# EAGLE design untitled (EAGLE 8.4.1)
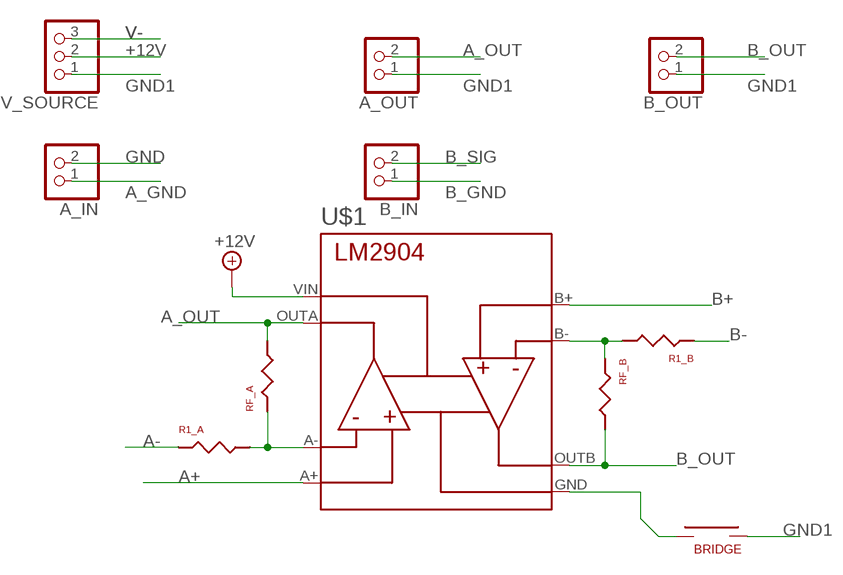
[diagram p0: schematic, sheet 1]

## Parts
A_IN  PINHD-1X2  [1X02]
A_OUT  PINHD-1X2  [1X02]
B_IN  PINHD-1X2  [1X02]
B_OUT  PINHD-1X2  [1X02]
R1_A  RESISTOR  [RESISTOR]
R1_B  RESISTOR  [RESISTOR]
RF_A  RESISTOR  [RESISTOR]
RF_B  RESISTOR  [RESISTOR]
U$1  LM2904  [LM2904]
U$2  BRIDGE  [BRIDGE]
V_SOURCE  PINHD-1X3  [1X03]

## Nets
+12V: U$1.VIN V_SOURCE.2
A+: U$1.A+
A-: R1_A.P$1
A_GND: A_IN.1
A_OUT: A_OUT.2 RF_A.P$2 U$1.OUTA
B+: U$1.B+
B-: R1_B.P$1
B_GND: B_IN.1
B_OUT: B_OUT.2 RF_B.P$2 U$1.OUTB
B_SIG: B_IN.2
GND: A_IN.2
GND1: A_OUT.1 B_OUT.1 U$2.P$2 V_SOURCE.1
N$3: R1_B.P$2 RF_B.P$1 U$1.B-
N$4: R1_A.P$2 RF_A.P$1 U$1.A-
V-: U$1.GND U$2.P$1 V_SOURCE.3

## Library data of the parts
A_IN A_OUT B_IN B_OUT = myLamp:PINHD-1X2: PIN HEADER
R1_A R1_B RF_A RF_B = myLamp:RESISTOR
U$1 = myLamp:LM2904
U$2 = myLamp:BRIDGE
V_SOURCE = myLamp:PINHD-1X3: PIN HEADER

## Board
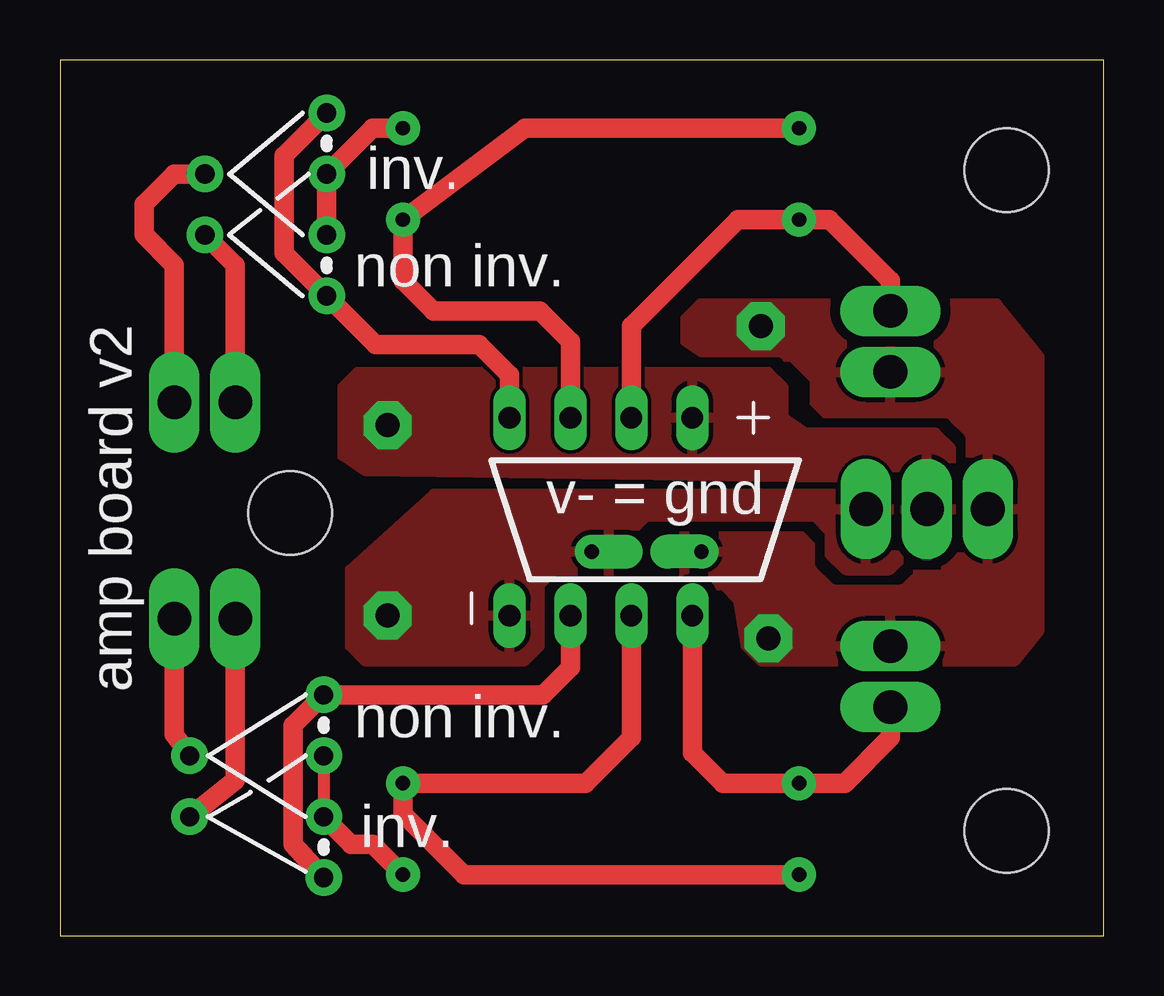
[diagram p1: board, top side]
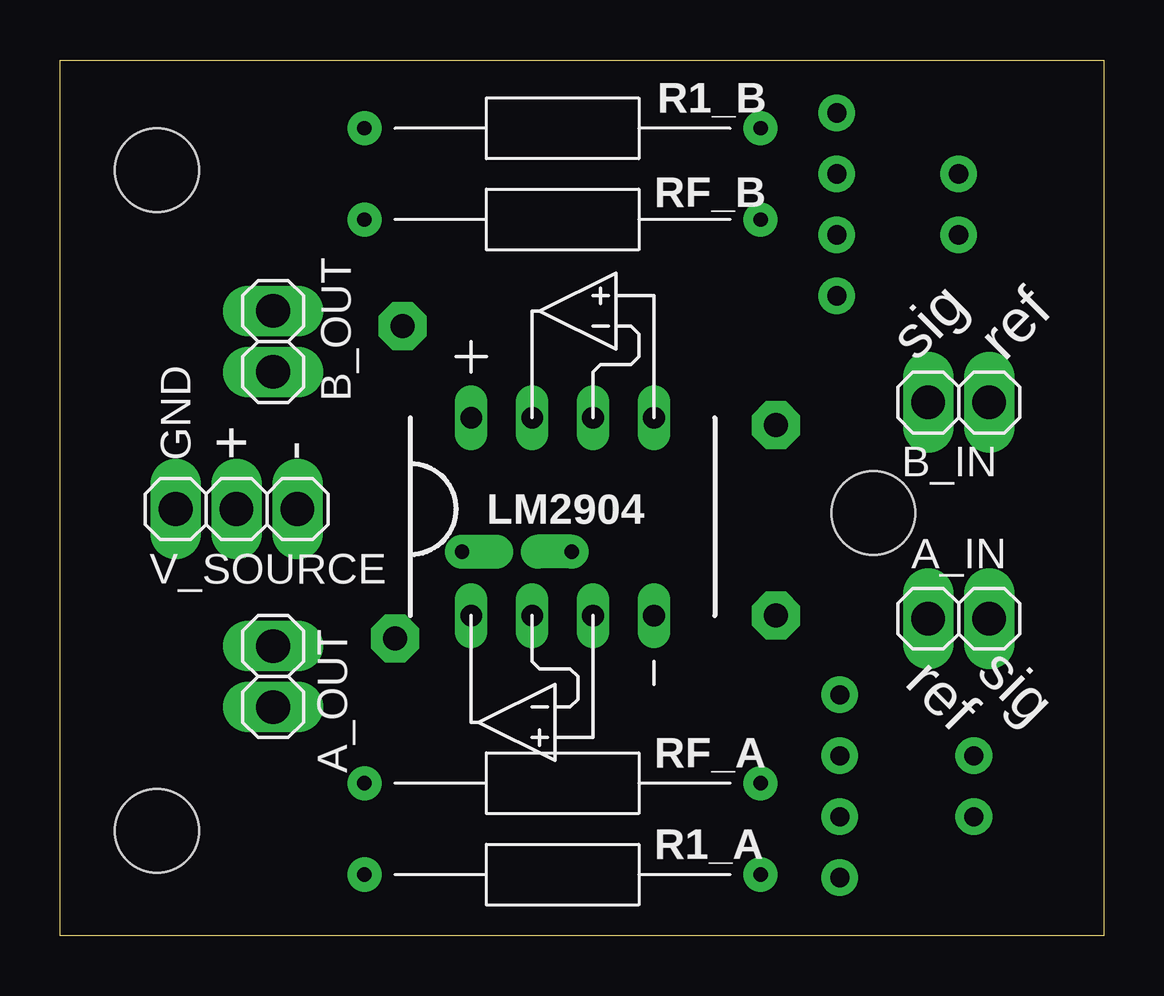
[diagram p2: board, bottom side, seen from below]

Size 43.5 x 36.5 mm. Coordinates in mm from the lower left corner, seen from the top.
Outline: 0,0 43.5,0 43.5,36.5 0,36.5 0,0
Copper layers (1*16): Top 0.018mm / dielectric 1.55mm / Bottom 0.018mm
Design rules "eC_2Layer_PClass6_BaseCopperO18_eCDefault": minimum track width 0.15mm, minimum drill 0.35mm, track to track 0.15mm, track to pad 0.15mm, pad to pad 0.15mm, via to via 0.15mm, smd to smd 0mil, copper to edge 0.25mm, drill to drill 0.35mm, minimum pad ring 0.175mm, minimum via ring 0.125mm, stop-mask expansion 0mil, vias tented up to drill 0.45mm, thermal gap 0.2mm
Holes 3.5 mm at 39.45,31.91 39.45,4.37 9.59,17.61

### Footprints (pad centres in the part's own frame; a part is rotated, then mirrored left to right if it is on the bottom)
1X02 = drill 1.4 long: 1 -1.27,0; 2 1.27,0
RESISTOR = drill 0.6 pad 1.422: P$1 0,0; P$2 16.51,0
LM2904 = drill 0.9 long: A+ 5.08,0; A- 2.54,0; B+ 7.62,8.255; B- 5.08,8.255; GND 7.62,0; OUTA 0,0; OUTB 2.54,8.255; VIN 0,8.255
BRIDGE = drill 0.6 pad 1.422 offset: P$1 0,0; P$2 4.572,0
1X03 = drill 1.4 long: 1 -2.54,0; 2 0,0; 3 2.54,0

### Placement (x,y rotation side)
A_IN  6.04,13.21 0 bottom
A_OUT  34.61,10.79 270 bottom
B_IN  6.04,22.23 180 bottom
B_OUT  34.61,24.77 90 bottom
R1_A  14.29,2.54 0 top
R1_B  14.29,33.66 0 top
RF_A  14.29,6.35 0 top
RF_B  14.29,29.84 0 top
U$1  26.36,13.34 0 bottom
U$2  22.17,16 0 top
V_SOURCE  36.14,17.78 0 bottom

### Tracks (layer width: path | path; a pad name or v marks a point on that pad's centre or on a via)
+12V  (via drill 1 pad 2)
  other vias: 13.66,21.27
  pour Top (isolate 0.127, rank 2): 11.76,22.86 11.76,20 12.71,19.37 35.25,19.05 35.25,16.51 35.88,15.88 36.52,15.88 37.16,16.51 37.16,20.32 36.52,20.95 31.12,20.95 30.17,21.59 30.17,22.86 29.54,23.5 12.39,23.5
A+  (via drill 0.8 pad 1.52)
  Top 0.813: v10.99,2.41 9.72,3.81 9.72,8.76 v10.99,10.03 20.14,10.03 21.28,11.18 U$1.A+
A-  (via drill 0.8 pad 1.52)
  Top 0.508: v10.99,7.49 v10.99,4.95
  Top 0.813: v10.99,4.95 12.14,3.81 13.03,3.81 R1_A.P$1
A_GND  (via drill 0.8 pad 1.52)
  Top 0.813: A_IN.1 7.31,6.48 v5.41,4.95
A_OUT
  Top 0.813: A_OUT.2 34.61,8.26 32.71,6.35 RF_A.P$2 27.63,6.35 26.36,7.62 U$1.OUTA
B+  (via drill 0.8 pad 1.52)
  Top 0.813: v11.12,34.29 9.34,32.51 9.34,28.45 v11.12,26.67 13.15,24.64 17.47,24.64 18.74,23.37 U$1.B+
B-  (via drill 0.8 pad 1.52)
  Top 0.813: v11.12,29.21 v11.12,31.75 13.03,33.66 R1_B.P$1
B_GND  (via drill 0.8 pad 1.52)
  Top 0.813: B_IN.1 4.77,27.94 3.5,29.21 3.5,30.48 4.77,31.75 v6.04,31.75
B_OUT
  Top 0.813: B_OUT.2 34.61,27.3 32.08,29.84 RF_B.P$2 28.27,29.84 23.82,25.4 U$1.OUTB
B_SIG  (via drill 0.8 pad 1.52)
  Top 0.813: B_IN.2 7.31,27.94 v6.04,29.21
GND  (via drill 0.8 pad 1.52)
  Top 0.813: A_IN.2 4.77,8.38 v5.41,7.49
GND1  (via drill 1 pad 2)
  other vias: 29.22,25.4 29.54,12.38
  pour Top (isolate 0.406, rank 3): 34.61,16.83 25.41,16.83 24.77,15.88 24.77,15.24 25.41,14.61 27.63,14.61 28.27,13.97 28.58,12.06 29.22,11.43 39.82,11.43 40.84,12.7 40.84,24.13 39.06,26.35 26.68,26.35 26.04,25.72 26.04,24.77 27,24.13 30.49,24.13 31.44,23.18 31.44,22.23 32.08,21.59 36.52,21.59 37.16,20.95 37.16,18.41 36.52,17.78 35.25,17.78
N$3
  Top 0.813: R1_B.P$2 19.38,33.66 RF_B.P$1 14.29,27.3 15.56,26.04 20.01,26.04 21.28,24.77 U$1.B-
N$4
  Top 0.813: R1_A.P$2 16.84,2.54 14.29,5.08 RF_A.P$1 21.91,6.35 23.82,8.26 U$1.A-
V-  (via drill 1 pad 2)
  other vias: 13.66,13.34
  pour Top (isolate 0.305): 12.07,12.06 12.71,11.43 19.38,11.43 20.01,12.06 20.01,14.61 20.64,15.24 23.18,15.24 23.82,15.88 23.82,16.83 24.45,17.46 31.44,17.46 32.08,16.83 32.08,15.88 32.71,15.24 34.61,15.24 35.25,15.88 35.25,17.78 33.66,18.41 15.56,18.41 12.07,15.24

### Text on the board
tPlace: inv. | non inv. | v- = gnd | amp board v2 | non inv. | inv.
bPlace: ref | sig | - | + | GND | sig | ref